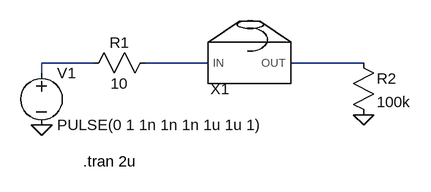
[diagram p0: schematic top_circuit.asc]
top_circuit.asc, the LTspice schematic file:
Version 4
SHEET 1 880 680
WIRE 96 96 16 96
WIRE 272 96 176 96
WIRE 512 96 400 96
WIRE 16 112 16 96
FLAG 16 192 0
FLAG 512 176 0
SYMBOL voltage 16 96 R0
WINDOW 123 0 0 Left 0
WINDOW 39 0 0 Left 0
SYMATTR InstName V1
SYMATTR Value PULSE(0 1 1n 1n 1n 1u 1u 1)
SYMBOL res 192 80 R90
WINDOW 0 0 56 VBottom 2
WINDOW 3 32 56 VTop 2
SYMATTR InstName R1
SYMATTR Value 10
SYMBOL sub_circuit 272 96 R0
WINDOW 0 4 40 Left 2
SYMATTR InstName X1
SYMBOL res 496 80 R0
SYMATTR InstName R2
SYMATTR Value 100k
TEXT 80 248 Left 2 !.tran 2u

The netlist it stands for:
* top_circuit.asc
V1 N001 0 PULSE(0 1 1n 1n 1n 1u 1u 1)
R1 N002 N001 10
XX1 N002 N003 sub_circuit  ; pins IN OUT
R2 N003 0 100k
.tran 2u
.backanno
.end